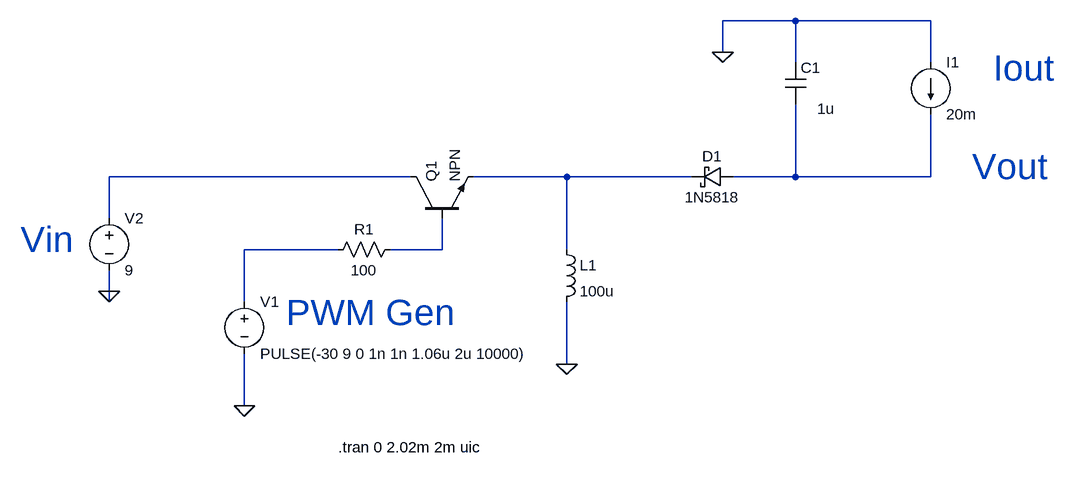
[diagram p0: schematic DC-DC Inverting.asc]
DC-DC Inverting.asc, the LTspice schematic file:
Version 4
SHEET 1 1608 680
WIRE 896 -192 784 -192
WIRE 1104 -192 896 -192
WIRE 784 -144 784 -192
WIRE 896 -128 896 -192
WIRE 1104 -128 1104 -192
WIRE 304 48 -160 48
WIRE 544 48 400 48
WIRE 736 48 544 48
WIRE 896 48 896 -64
WIRE 896 48 800 48
WIRE 1104 48 1104 -48
WIRE 1104 48 896 48
WIRE -160 112 -160 48
WIRE 192 160 48 160
WIRE 352 160 352 112
WIRE 352 160 272 160
WIRE 544 160 544 48
WIRE -160 224 -160 192
WIRE -160 240 -160 224
WIRE 48 240 48 160
WIRE 544 336 544 240
WIRE 48 400 48 320
FLAG 544 336 0
FLAG 48 400 0
FLAG 784 -144 0
FLAG -160 224 0
SYMBOL voltage 48 224 R0
WINDOW 123 0 0 Left 2
WINDOW 39 0 0 Left 2
SYMATTR InstName V1
SYMATTR Value PULSE(-30 9 0 1n 1n 1.06u 2u 10000)
SYMBOL schottky 800 32 R90
WINDOW 0 0 32 VBottom 2
WINDOW 3 32 32 VTop 2
SYMATTR InstName D1
SYMATTR Value 1N5818
SYMATTR Description Diode
SYMATTR Type diode
SYMBOL ind 528 144 R0
SYMATTR InstName L1
SYMATTR Value 100u
SYMBOL cap 880 -128 R0
WINDOW 3 49 71 Left 2
SYMATTR InstName C1
SYMATTR Value 1u
SYMBOL current 1104 -128 R0
WINDOW 123 0 0 Left 2
WINDOW 39 0 0 Left 2
SYMATTR InstName I1
SYMATTR Value 20m
SYMBOL voltage -160 96 R0
WINDOW 123 0 0 Left 2
WINDOW 39 0 0 Left 2
SYMATTR InstName V2
SYMATTR Value 9
SYMBOL res 288 144 R90
WINDOW 0 0 56 VBottom 2
WINDOW 3 32 56 VTop 2
SYMATTR InstName R1
SYMATTR Value 100
SYMBOL npn 304 112 R270
SYMATTR InstName Q1
TEXT 192 464 Left 2 !.tran 0 2.02m 2m uic
TEXT -296 144 Left 5 ;Vin
TEXT 1200 -120 Left 5 ;Iout
TEXT 1168 32 Left 5 ;Vout
TEXT 112 256 Left 5 ;PWM Gen

The netlist it stands for:
* DC-DC Inverting.asc
V1 N004 0 PULSE(-30 9 0 1n 1n 1.06u 2u 10000)
D1 N003 N002 1N5818
L1 N002 0 100u
C1 0 N003 1u
I1 0 N003 20m
V2 N001 0 9
R1 N005 N004 100
Q1 N001 N005 N002 0 NPN
.model D D
.lib standard.dio
.model NPN NPN
.model PNP PNP
.lib standard.bjt
.tran 0 2.02m 2m uic
* Vin
* Iout
* Vout
* PWM Gen
.backanno
.end